# Altium schematic sheet Candunio.SchDoc
size A4
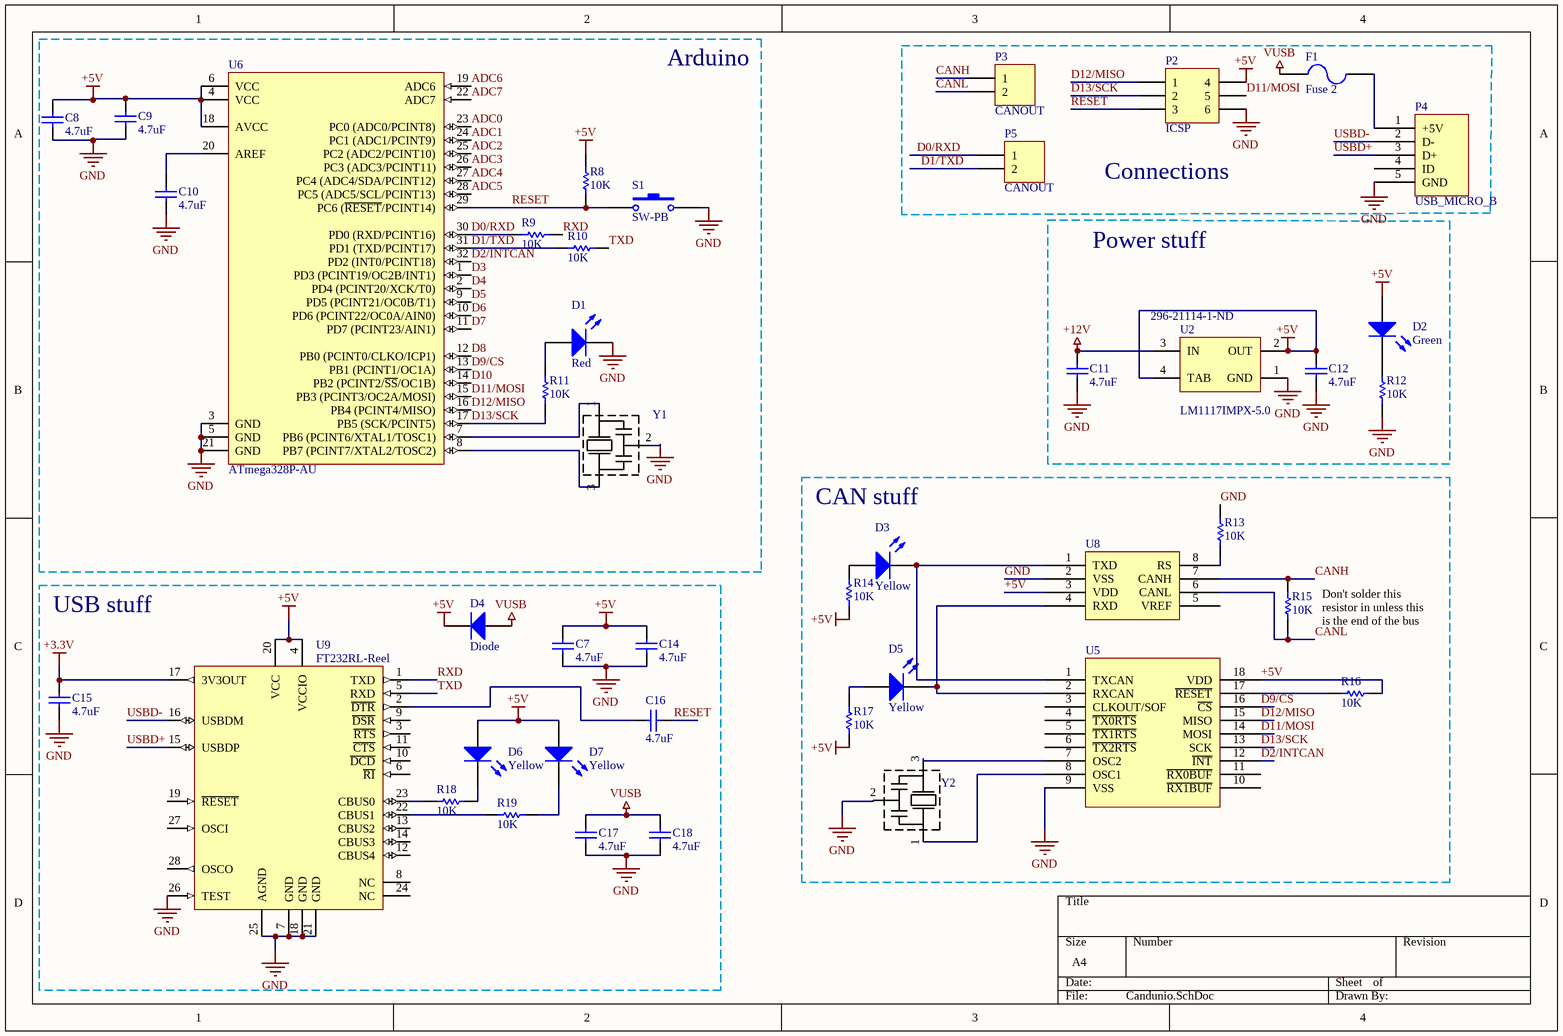
[diagram p0: Candunio.SchDoc]

## Parts
C7  4.7uF  [CAPC3216X170N]
C8  4.7uF  [CAPC3216X170N]
C9  4.7uF  [CAPC3216X170N]
C10  4.7uF  [CAPC3216X170N]
C11  4.7uF  [CAPC3216X170N]
C12  4.7uF  [CAPC3216X170N]
C14  4.7uF  [CAPC3216X170N]
C15  4.7uF  [CAPC3216X170N]
C16  4.7uF  [CAPC3216X170N]
C17  4.7uF  [CAPC3216X170N]
C18  4.7uF  [CAPC3216X170N]
D1  Red  [LEDC3216X120NRED]
D2  Green  [LEDC3216X120NGRN]
D3  Yellow  [LEDC3216X120NYEL]
D4  Diode  [DO-220AA]
D5  Yellow  [LEDC3216X120NYEL]
D6  Yellow  [LEDC3216X120NYEL]
D7  Yellow  [LEDC3216X120NYEL]
F1  Fuse 2  [FUSC4632X85N]
P2  ICSP  [Pin Header 2x3 TH Pitch 2.54mm]
P3  CANOUT  [Pin Header 1x2 TH Pitch 2.54mm]
P4  USB_MICRO_B  [USB MICRO B THRU]
P5  CANOUT  [Pin Header 1x2 TH Pitch 2.54mm]
R8  10K  [RESC3216X60N]
R9  10K  [RESC3216X60N]
R10  10K  [RESC3216X60N]
R11  10K  [RESC3216X60N]
R12  10K  [RESC3216X60N]
R13  10K  [RESC3216X60N]
R14  10K  [RESC3216X60N]
R15  10K  [RESC3216X60N]
R16  10K  [RESC3216X60N]
R17  10K  [RESC3216X60N]
R18  10K  [RESC3216X60N]
R19  10K  [RESC3216X60N]
S1  SW-PB  [SMDswitch_1206]
U2  LM1117IMPX-5.0  Supplier Part Number: 296-21114-1-ND  [SOT230P700X180-4N]
U5  MCP2515-E/ST  [SOIC127P1030X265-18N]  (value not drawn)
U6  ATmega328P-AU  [QFP80P900X900X120-32N]
U8  MCP2551-E/SN  [SOIC127P600X175-8N]  (value not drawn)
U9  FT232RL-Reel  [SOP65P780X200-28N]
Y1  CSTCE16M0V53-R0  [CSTCE_G]  (value not drawn)
Y2  CSTCE16M0V53-R0  [CSTCE_G]  (value not drawn)

## Blocks framed on the sheet
Arduino: C8-C10 D1 R8-R11 S1 U6 Y1
Connections: F1 P2-P5
Power stuff: C11 C12 D2 R12 U2
CAN stuff: D3 D5 R13-R17 U5 U8 Y2
USB stuff: C7 C14-C18 D4 D6 D7 R18 R19 U9

## Nets
+3.3V: C15.2 U9.17(3V3OUT)
+5V: C7.2 C8.1 C9.2 C12.2 C14.2 D2.1(A) D4.2(K) D6.1(A) D7.1(A) P2.4 R8.1 R14.1 R16.2 R17.2 U2.2(OUT) U2.4(TAB) U5.18(VDD) U6.4(VCC) U6.6(VCC) U6.18(AVCC) U8.3(VDD) U9.4(VCCIO) U9.20(VCC)
+12V: C11.2 U2.3(IN)
GND: C7.1 C8.2 C9.1 C10.1 C11.1 C12.1 C14.1 C15.1 C17.1 C18.1 D1.2(K) P2.6 P4.5(GND) R12.2 R13.1 S1.2 U2.1(GND) U5.9(VSS) U6.3(GND) U6.5(GND) U6.21(GND) U8.2(VSS) U9.7(GND) U9.18(GND) U9.21(GND) U9.25(AGND) U9.26(TEST) Y1.2 Y2.2
VUSB: C17.2 C18.2 D4.1(A) F1.1
ADC0: U6.23(PC0_(ADC0/PCINT8))
ADC1: U6.24(PC1_(ADC1/PCINT9))
ADC2: U6.25(PC2_(ADC2/PCINT10))
ADC3: U6.26(PC3_(ADC3/PCINT11))
ADC4: U6.27(PC4_(ADC4/SDA/PCINT12))
ADC5: U6.28(PC5_(ADC5/SCL/PCINT13))
ADC6: U6.19(ADC6)
ADC7: U6.22(ADC7)
CANH: P3.1 R15.1 U8.7(CANH)
CANL: P3.2 R15.2 U8.6(CANL)
D0/RXD: P5.1 R9.1 U6.30(PD0_(RXD/PCINT16))
D1/TXD: P5.2 R10.1 U6.31(PD1_(TXD/PCINT17))
D2/INTCAN: U5.12(~{INT}) U6.32(PD2_(INT0/PCINT18))
D3: U6.1(PD3_(PCINT19/OC2B/INT1))
D4: U6.2(PD4_(PCINT20/XCK/T0))
D5: U6.9(PD5_(PCINT21/OC0B/T1))
D6: U6.10(PD6_(PCINT22/OC0A/AIN0))
D7: U6.11(PD7_(PCINT23/AIN1))
D8: U6.12(PB0_(PCINT0/CLKO/ICP1))
D9/CS: U5.16(~{CS}) U6.13(PB1_(PCINT1/OC1A))
D10: U6.14(PB2_(PCINT2/~{SS}/OC1B))
D11/MOSI: P2.5 U5.14(MOSI) U6.15(PB3_(PCINT3/OC2A/MOSI))
D12/MISO: P2.1 U5.15(MISO) U6.16(PB4_(PCINT4/MISO))
D13/SCK: P2.2 R11.2 U5.13(SCK) U6.17(PB5_(SCK/PCINT5))
RESET: C16.2 P2.3 R8.2 S1.1 U6.29(PC6_(~{RESET}/PCINT14))
RXD: R9.2 U9.1(TXD)
TXD: R10.2 U9.5(RXD)
USBD+: P4.3(D+) U9.15(USBDP)
USBD-: P4.2(D-) U9.16(USBDM)
NetC10_2: C10.2 U6.20(AREF)
NetC16_1: C16.1 U9.2(~{DTR})
NetD1_1: D1.1(A) R11.1
NetD2_2: D2.2(K) R12.1
NetD3_1: D3.1(A) R14.2
NetD3_2: D3.2(K) U5.1(TXCAN) U8.1(TXD)
NetD5_1: D5.1(A) R17.1
NetD5_2: D5.2(K) U5.2(RXCAN) U8.4(RXD)
NetD6_2: D6.2(K) R18.2
NetD7_2: D7.2(K) R19.2
NetF1_2: F1.2 P4.1(+5V)
NetR13_2: R13.2 U8.8(RS)
NetR16_1: R16.1 U5.17(~{RESET})
NetR18_1: R18.1 U9.23(CBUS0)
NetR19_1: R19.1 U9.22(CBUS1)
NetU5_7: U5.7(OSC2) Y2.3
NetU5_8: U5.8(OSC1) Y2.1
NetU6_7: U6.7(PB6_(PCINT6/XTAL1/TOSC1)) Y1.1
NetU6_8: U6.8(PB7_(PCINT7/XTAL2/TOSC2)) Y1.3

Not connected (* = marked no-connect by the designer): P4 4(ID); U5 3(CLKOUT/SOF) 4(~{TX0RTS}) 5(~{TX1RTS}) 6(~{TX2RTS}) 10(~{RX1BUF}) 11(~{RX0BUF}); U8 5(VREF); U9 3(~{RTS}) 6(~{RI}) 8(NC) 9(~{DSR}) 10(~{DCD}) 11(~{CTS}) 12(CBUS4) 13(CBUS2) 14(CBUS3) 19(~{RESET}) 24(NC) 27(OSCI) 28(OSCO)

## Notes on the sheet
- (near R15) Don't solder this resistor in unless this is the end of the bus

## Library data of the parts
C7-C12 C14-C18 = Cap Semi: Capacitor (Semiconductor SIM Model); Manufacturer: Murata; Manufacturer Part Number: GRM31MR71H105KA88L; Material: Ceramic; Tolerance: 10%; Voltage Rating: 50V; Capacitance: 1uF; Dielectric: X7R; Published: 8-Jun-2000; LatestRevisionDate: 29-May-2009; LatestRevisionNote: IPC-7351 Footprint Added.; PackageReference: C1206; Publisher: Altium Limited; PackageDescription: Chip Capacitor; Value: 4.7uF; Supplier 1: Digi-Key; Stock 1: 0; Mount: Surface Mount; Case/Package: 1206; Number of Pins: 2; Case Code (Metric): 3216; Case Code (Imperial): 1206; Min Operating Temperature: -55°C; Max Operating Temperature: 125°C; Package Quantity: 1; Packaging: Tape and Reel; Voltage Rating (DC): 50V; Termination: SMD/SMT; Voltage: 50V; Length: 3.2mm; Height: 1.15mm; Width: 0.063inch; Thickness: 0.049inch; Depth: 1.6mm; REACH SVHC: No SVHC; Lead Free: Lead Free; ComponentLink1URL: https://datasheet.ciiva.com/16379/product-16379616.pdf; ComponentLink1Description: https://datasheet.ciiva.com/16379/product-16379616.pdf; ComponentLink2URL: https://datasheet.ciiva.com/14116/nmgrm-data-en-14116709.pdf; ComponentLink2Description: https://datasheet.ciiva.com/14116/nmgrm-data-en-14116709.pdf; ComponentLink3URL: https://datasheet.ciiva.com/22703/608985-22703384.pdf; ComponentLink3Description: https://datasheet.ciiva.com/22703/608985-22703384.pdf; ComponentLink4URL: https://datasheet.ciiva.com/3777/42grm31mr71h105ka8823-3777081.pdf; ComponentLink4Description: https://datasheet.ciiva.com/3777/42grm31mr71h105ka8823-3777081.pdf; ComponentLink5URL: https://datasheet.ciiva.com/6270/partnumbering-e-01-6270398.pdf; ComponentLink5Description: https://datasheet.ciiva.com/6270/partnumbering-e-01-6270398.pdf; ComponentLink6URL: https://datasheet.ciiva.com/6270/partnumbering-e-01-6270399.pdf; ComponentLink6Description: https://datasheet.ciiva.com/6270/partnumbering-e-01-6270399.pdf; ComponentLink7URL: https://datasheet.ciiva.com/29199/455056-da-01-en-vs-kondensator-1206-29199449.pdf; ComponentLink7Description: https://datasheet.ciiva.com/29199/455056-da-01-en-vs-kondensator-1206-29199449.pdf; ComponentLink8URL: https://datasheet.ciiva.com/29202/450923-da-01-de-vs-chip-kond-1206-1-0-uf-10pr-50-0v-x7r-29202718.pdf; ComponentLink8Description: https://datasheet.ciiva.com/29202/450923-da-01-de-vs-chip-kond-1206-1-0-uf-10pr-50-0v-x7r-29202718.pdf; Supplier 2: Digi-Key; Supplier Part Number: 1276-1055-1-ND
D1 = LED2_2: Typical RED, GREEN, YELLOW, AMBER GaAs LED; Manufacturer: Broadcom Avago; Manufacturer Part Number: HSMY-C150; Lens Colour: White,Clear; Viewing Angle: 170°; Lens Style: Diffused,Colorless,Rectangular; Wavelength: 586nm; Luminous Intensity: 8mcd; Forward Current: 20mA; Forward Voltage: 2.1V; Number of LEDs: 1; Reverse Voltage: 5V; Power Dissipation: 65mW; Lens Transparency: Diffused; Published: 8-Jun-2000; LatestRevisionDate: 17-Jul-2002; LatestRevisionNote: Re-released for DXP Platform.; PackageVersion: Feb-2002; PackageReference: 3.2X1.6X1.1; Publisher: Altium Limited; PackageDescription: SM LED; 2 Flat Leads; Supplier 1: Digi-Key; Stock 1: 0; Mount: Surface Mount; Case/Package: 1206; Number of Pins: 2; Colour: Yellow; Case Code (Metric): 3216; Case Code (Imperial): 1206; Contact Plating: Gold; Min Operating Temperature: -40°C; Max Operating Temperature: 85°C; Packaging: Tape and Reel; Package Quantity: 1; Illumination Colour: Yellow; Dominant Wavelength: 586nm; Test Current: 20mA; Number of Elements: 1; Power Rating: 65mW; Max Power Dissipation: 65mW; Voltage Rating (DC): 2.1V; Length: 3.2mm; Height: 1.1mm; Width: 1.6mm; Depth: 1.6mm; Radiation Hardening: No; REACH SVHC: No SVHC; Lead Free: Lead Free; ComponentLink1URL: https://datasheet.ciiva.com/15117/getdatasheetpartid-110528-15117488.pdf; ComponentLink1Description: https://datasheet.ciiva.com/15117/getdatasheetpartid-110528-15117488.pdf; ComponentLink2URL: https://datasheet.ciiva.com/11774/0900766b804a6539-11774578.pdf; ComponentLink2Description: https://datasheet.ciiva.com/11774/0900766b804a6539-11774578.pdf; ComponentLink3URL: https://datasheet.ciiva.com/19466/1557071-19466435.pdf; ComponentLink3Description: https://datasheet.ciiva.com/19466/1557071-19466435.pdf; ComponentLink4URL: https://datasheet.ciiva.com/14172/swseriehsmx-c150toc190-e-14172159.pdf; ComponentLink4Description: https://datasheet.ciiva.com/14172/swseriehsmx-c150toc190-e-14172159.pdf; ComponentLink5URL: https://datasheet.ciiva.com/29280/180507-da-01-en-chip-led-hsmy-c150-gelb-29280997.pdf; ComponentLink5Description: https://datasheet.ciiva.com/29280/180507-da-01-en-chip-led-hsmy-c150-gelb-29280997.pdf; Supplier 2: Digi-Key; Stock 2: 0; ComponentLink6URL: https://datasheet.ciiva.com/11773/0900766b804a6539-11773956.pdf; ComponentLink6Description: https://datasheet.ciiva.com/11773/0900766b804a6539-11773956.pdf; ComponentLink7URL: https://datasheet.ciiva.com/15117/getdatasheetpartid-142358-15117749.pdf; ComponentLink7Description: https://datasheet.ciiva.com/15117/getdatasheetpartid-142358-15117749.pdf; ComponentLink8URL: https://datasheet.ciiva.com/46426/313031-46426533.pdf; ComponentLink8Description: https://datasheet.ciiva.com/46426/313031-46426533.pdf; ComponentLink9URL: https://datasheet.ciiva.com/14172/swseriehsmx-c150toc190-e-14172156.pdf; ComponentLink9Description: https://datasheet.ciiva.com/14172/swseriehsmx-c150toc190-e-14172156.pdf; ComponentLink10URL: https://datasheet.ciiva.com/29281/180509-da-01-en-chip-led-hsmh-c150-rot-29281009.pdf; ComponentLink10Description: https://datasheet.ciiva.com/29281/180509-da-01-en-chip-led-hsmh-c150-rot-29281009.pdf; Supplier 3: Digi-Key; Supplier 4: Digi-Key; Supplier Part Number: 732-4992-1-ND
D2 = LED2: Typical RED, GREEN, YELLOW, AMBER GaAs LED; Manufacturer: Broadcom Avago; Manufacturer Part Number: HSMG-C150; Lens Colour: White,Clear; Viewing Angle: 170°; Lens Style: Diffused,Colorless,Rectangular; Luminous Intensity: 15mcd; Forward Voltage: 2.2V; Forward Current: 20mA; Wavelength: 572nm; Number of LEDs: 1; Power Rating: 65mW; Reverse Voltage: 5V; Lens Transparency: Diffused; Published: 8-Jun-2000; LatestRevisionDate: 17-Jul-2002; LatestRevisionNote: Re-released for DXP Platform.; PackageVersion: Feb-2002; PackageReference: 3.2X1.6X1.1; Publisher: Altium Limited; PackageDescription: SM LED; 2 Flat Leads; Mount: Surface Mount; Case/Package: 1206; Number of Pins: 2; Colour: Green,Yellow; Case Code (Metric): 3216; Case Code (Imperial): 1206; Contact Plating: Gold; Min Operating Temperature: -30°C; Max Operating Temperature: 85°C; Packaging: Tape and Reel; Package Quantity: 1; Illumination Colour: Green; Dominant Wavelength: 572nm; Test Current: 20mA; Number of Elements: 1; Power Dissipation: 65mW; Max Power Dissipation: 65mW; Length: 3.2mm; Height: 1.1mm; Width: 1.6mm; Depth: 1.6mm; Radiation Hardening: No; REACH SVHC: No SVHC; ComponentLink1URL: https://datasheet.ciiva.com/11774/0900766b804a6539-11774272.pdf; ComponentLink1Description: https://datasheet.ciiva.com/11774/0900766b804a6539-11774272.pdf; ComponentLink2URL: https://datasheet.ciiva.com/14172/swseriehsmx-c150toc190-e-14172162.pdf; ComponentLink2Description: https://datasheet.ciiva.com/14172/swseriehsmx-c150toc190-e-14172162.pdf; ComponentLink3URL: https://datasheet.ciiva.com/46426/313031-46426517.pdf; ComponentLink3Description: https://datasheet.ciiva.com/46426/313031-46426517.pdf; ComponentLink4URL: https://datasheet.ciiva.com/15117/getdatasheetpartid-110366-15117482.pdf; ComponentLink4Description: https://datasheet.ciiva.com/15117/getdatasheetpartid-110366-15117482.pdf; ComponentLink5URL: https://datasheet.ciiva.com/19466/1556369-19466015.pdf; ComponentLink5Description: https://datasheet.ciiva.com/19466/1556369-19466015.pdf; ComponentLink6URL: https://datasheet.ciiva.com/29280/180668-da-01-en-chip-led-hsmg-c150-gelb-gruen-29280632.pdf; ComponentLink6Description: https://datasheet.ciiva.com/29280/180668-da-01-en-chip-led-hsmg-c150-gelb-gruen-29280632.pdf; Supplier 1: Digi-Key; Supplier 2: Digi-Key; Supplier Part Number: 732-4993-1-ND
D3 D5-D7 = LED2_1: Typical RED, GREEN, YELLOW, AMBER GaAs LED; Manufacturer: Broadcom Avago; Manufacturer Part Number: HSMY-C150; Lens Colour: White,Clear; Viewing Angle: 170°; Lens Style: Diffused,Colorless,Rectangular; Wavelength: 586nm; Luminous Intensity: 8mcd; Forward Current: 20mA; Forward Voltage: 2.1V; Number of LEDs: 1; Reverse Voltage: 5V; Power Dissipation: 65mW; Lens Transparency: Diffused; Published: 8-Jun-2000; LatestRevisionDate: 17-Jul-2002; LatestRevisionNote: Re-released for DXP Platform.; PackageVersion: Feb-2002; PackageReference: 3.2X1.6X1.1; Publisher: Altium Limited; PackageDescription: SM LED; 2 Flat Leads; Supplier 1: Digi-Key; Stock 1: 0; Mount: Surface Mount; Case/Package: 1206; Number of Pins: 2; Colour: Yellow; Case Code (Metric): 3216; Case Code (Imperial): 1206; Contact Plating: Gold; Min Operating Temperature: -40°C; Max Operating Temperature: 85°C; Packaging: Tape and Reel; Package Quantity: 1; Illumination Colour: Yellow; Dominant Wavelength: 586nm; Test Current: 20mA; Number of Elements: 1; Power Rating: 65mW; Max Power Dissipation: 65mW; Voltage Rating (DC): 2.1V; Length: 3.2mm; Height: 1.1mm; Width: 1.6mm; Depth: 1.6mm; Radiation Hardening: No; REACH SVHC: No SVHC; Lead Free: Lead Free; ComponentLink1URL: https://datasheet.ciiva.com/15117/getdatasheetpartid-110528-15117488.pdf; ComponentLink1Description: https://datasheet.ciiva.com/15117/getdatasheetpartid-110528-15117488.pdf; ComponentLink2URL: https://datasheet.ciiva.com/11774/0900766b804a6539-11774578.pdf; ComponentLink2Description: https://datasheet.ciiva.com/11774/0900766b804a6539-11774578.pdf; ComponentLink3URL: https://datasheet.ciiva.com/19466/1557071-19466435.pdf; ComponentLink3Description: https://datasheet.ciiva.com/19466/1557071-19466435.pdf; ComponentLink4URL: https://datasheet.ciiva.com/14172/swseriehsmx-c150toc190-e-14172159.pdf; ComponentLink4Description: https://datasheet.ciiva.com/14172/swseriehsmx-c150toc190-e-14172159.pdf; ComponentLink5URL: https://datasheet.ciiva.com/29280/180507-da-01-en-chip-led-hsmy-c150-gelb-29280997.pdf; ComponentLink5Description: https://datasheet.ciiva.com/29280/180507-da-01-en-chip-led-hsmy-c150-gelb-29280997.pdf; Supplier 2: Digi-Key; Supplier Part Number: 732-4994-1-ND
D4 = Diode: Default Diode; Published: 8-Jun-2000; LatestRevisionDate: 17-Jul-2002; LatestRevisionNote: Re-released for DXP Platform.; PackageVersion: Sep-1996; PackageReference: SMC; Publisher: Altium Limited; PackageDescription: DO-214-AB/SMC; 2 C-Bend Leads; Body 7.9 x 5.9 mm, inc. leads (LxW); Code_JEDEC: DO-214-AB; Supplier 1: Digi-Key; Supplier 2: Digi-Key; Supplier Part Number: SS1P3L-M3/84AGICT-ND
F1 = Fuse 2: Fuse; part number: MF-MSMF050-2; Manufacturer: Bourns; Max Current Rating: 100A; Hold Current: 500mA; Trip Current: 1A; Power Dissipation: 800mW; Voltage Rating: 15V; Resistance: 150mR; Time to Trip: 0.15s; Approvals: UL,CSA,TUV; Published: 8-Jun-2000; LatestRevisionDate: 17-Jul-2002; LatestRevisionNote: Re-released for DXP Platform.; PackageReference: PIN-W2/E2.8; Publisher: Altium Limited; PackageDescription: Thru-Hole; 2 Leads; Supplier 1: Digi-Key; Supplier Part Number: ‎MF-MSMF050-2CT-ND; Manufacturer Part Number: MF-MSMF050-2; Stock 1: 126000; Pricing 1: 2000=0.2898, 4000=0.28463, 6000=0.27945, 10000=0.2691 (USD); Mount: Surface Mount,PCB; Case/Package: 1812; Case Code (Metric): 4532; Case Code (Imperial): 1812; Number of Terminals: 2; Contact Plating: Gold; Terminal Material: Gold; Min Operating Temperature: -40°C; Max Operating Temperature: 85°C; Packaging: Tape and Reel; Package Quantity: 2000; Operating Supply Voltage: 15V; Current Rating: 100A; Termination: SMD/SMT; Voltage Rating (DC): 15V; Length: 4.73mm; Height: 0.85mm; Width: 3.41mm; Radiation Hardening: No; REACH SVHC: No SVHC; Lead Free: Lead Free; ComponentLink1URL: https://datasheet.ciiva.com/326/mfmsmf-326354.pdf; ComponentLink1Description: https://datasheet.ciiva.com/326/mfmsmf-326354.pdf; ComponentLink2URL: https://datasheet.ciiva.com/1228/1786007-1228155.pdf; ComponentLink2Description: https://datasheet.ciiva.com/1228/1786007-1228155.pdf; ComponentLink3URL: https://datasheet.ciiva.com/16205/mfmsmf-16205994.pdf; ComponentLink3Description: https://datasheet.ciiva.com/16205/mfmsmf-16205994.pdf; ComponentLink4URL: https://datasheet.ciiva.com/34302/1164200-34302041.pdf; ComponentLink4Description: https://datasheet.ciiva.com/34302/1164200-34302041.pdf; ComponentLink5URL: https://datasheet.ciiva.com/14537/70153434-14537737.pdf; ComponentLink5Description: https://datasheet.ciiva.com/14537/70153434-14537737.pdf; ComponentLink6URL: https://datasheet.ciiva.com/46395/1695373-46395287.pdf; ComponentLink6Description: https://datasheet.ciiva.com/46395/1695373-46395287.pdf; ComponentLink7URL: https://datasheet.ciiva.com/22749/1695373-22749079.pdf; ComponentLink7Description: https://datasheet.ciiva.com/22749/1695373-22749079.pdf; ComponentLink8URL: https://datasheet.ciiva.com/32426/mf-msmf-series-eng-tds-32426126.pdf; ComponentLink8Description: https://datasheet.ciiva.com/32426/mf-msmf-series-eng-tds-32426126.pdf; ComponentLink9URL: https://datasheet.ciiva.com/4501/mfmsmf-72300-4501655.pdf; ComponentLink9Description: https://datasheet.ciiva.com/4501/mfmsmf-72300-4501655.pdf; ComponentLink10URL: https://datasheet.ciiva.com/3019/mfmsmf-3019622.pdf; ComponentLink10Description: https://datasheet.ciiva.com/3019/mfmsmf-3019622.pdf; ComponentLink11URL: https://datasheet.ciiva.com/3019/mfmsmf-3019621.pdf; ComponentLink11Description: https://datasheet.ciiva.com/3019/mfmsmf-3019621.pdf; ComponentLink12URL: https://datasheet.ciiva.com/326/mfmsmf-326356.pdf; ComponentLink12Description: https://datasheet.ciiva.com/326/mfmsmf-326356.pdf; ComponentLink13URL: https://datasheet.ciiva.com/1274/1786007-1274499.pdf; ComponentLink13Description: https://datasheet.ciiva.com/1274/1786007-1274499.pdf; ComponentLink14URL: https://datasheet.ciiva.com/326/mfmsmf-326355.pdf; ComponentLink14Description: https://datasheet.ciiva.com/326/mfmsmf-326355.pdf; ComponentLink15URL: https://datasheet.ciiva.com/1274/1786007-1274498.pdf; ComponentLink15Description: https://datasheet.ciiva.com/1274/1786007-1274498.pdf; ComponentLink16URL: https://datasheet.ciiva.com/15226/getdatasheetpartid-117168-15226886.pdf; ComponentLink16Description: https://datasheet.ciiva.com/15226/getdatasheetpartid-117168-15226886.pdf; ComponentLink17URL: https://datasheet.ciiva.com/25894/mfmsmf-25894175.pdf; ComponentLink17Description: https://datasheet.ciiva.com/25894/mfmsmf-25894175.pdf
P2 = Header 3X2A: Header, 3-Pin, Dual row; LatestRevisionDate: 17-Jul-2002; LatestRevisionNote: Re-released for DXP Platform.; Publisher: Altium Limited
P3 P5 = Header 2: Header, 2-Pin; LatestRevisionDate: 17-Jul-2002; LatestRevisionNote: Re-released for DXP Platform.; Publisher: Altium Limited
R8-R14 R16-R19 = Res1: Resistor; Manufacturer: Stackpole Electronics; Manufacturer Part Number: RNCP1206FTD1K00; Resistance: 10kR; Tolerance: 1%; Temperature Coefficient: 100ppm/°C; Max Power Dissipation: 500mW; Value: 10K; Supplier Part Number: RNCP1206FTD10K0CT-ND; Supplier 1: Digi-Key; Stock 1: 679; Pricing 1: 1=0.1, 10=0.052, 100=0.0211, 1000=0.00949, 2500=0.00824 (USD); Mount: Surface Mount; Case/Package: 1206; Case Code (Metric): 3216; Case Code (Imperial): 1206; Contact Plating: Nickel,Tin,Matte; Min Operating Temperature: -55°C; Max Operating Temperature: 155°C; Packaging: Tape and Reel; Composition: Thin Film; Number of Terminations: 2; Length: 0.122inch; Height: 0.024inch; Width: 0.059inch; Radiation Hardening: No; Lead Free: Lead Free; ComponentLink1URL: http://www.seielect.com/Catalog/SEI-rncp.pdf; ComponentLink1Description: http://www.seielect.com/Catalog/SEI-rncp.pdf; ComponentLink2URL: https://www.seielect.com/catalog/SEI-Packaging.pdf; ComponentLink2Description: https://www.seielect.com/catalog/SEI-Packaging.pdf
R15 = Res1: Resistor; Manufacturer: Stackpole Electronics; Manufacturer Part Number: RNCP1206FTD1K00; Resistance: 10kR; Temperature Coefficient: 100ppm/°C; Tolerance: 1%; Max Power Dissipation: 500mW; Value: 10K; Supplier 1: Digi-Key; Stock 1: 679; Case/Package: 1206; Case Code (Imperial): 1206; Case Code (Metric): 3216; Contact Plating: Nickel,Tin,Matte; Min Operating Temperature: -55°C; Max Operating Temperature: 155°C; Packaging: Tape and Reel; Composition: Thin Film; Length: 0.122inch; Height: 0.024inch; Width: 0.059inch; Radiation Hardening: No; Lead Free: Lead Free; ComponentLink1URL: http://www.seielect.com/Catalog/SEI-rncp.pdf; ComponentLink1Description: http://www.seielect.com/Catalog/SEI-rncp.pdf; ComponentLink2URL: https://www.seielect.com/catalog/SEI-Packaging.pdf; ComponentLink2Description: https://www.seielect.com/catalog/SEI-Packaging.pdf; Supplier Part Number: RNCP1206FTD10K0CT-ND; Pricing 1: 1=0.1, 10=0.052, 100=0.0211, 1000=0.00949, 2500=0.00824 (USD); Mount: Surface Mount; Number of Terminations: 2
S1 = SW-PB: Switch; Manufacturer: ITT C&K; Manufacturer Part Number: KXT331LHS; Published: 24-Mar-1999; LatestRevisionDate: 17-Jul-2002; LatestRevisionNote: Re-released for DXP Platform.; PackageReference: SPST-2; Publisher: Altium Limited; PackageDescription: Switch; 2 Leads; Supplier 1: Digi-Key; Supplier Part Number: CKN10779CT-ND; Stock 1: 42500; Pricing 1: 8500=0.1264 (USD); ComponentLink1URL: https://www.ckswitches.com/media/1465/kxt3.pdf; ComponentLink1Description: https://www.ckswitches.com/media/1465/kxt3.pdf; ComponentLink2URL: http://www.ckswitches.com/media/1465/kxt3.pdf; ComponentLink2Description: http://www.ckswitches.com/media/1465/kxt3.pdf
U2 = LM1117IMPX-5.0: 800mA Low-Dropout Linear Regulator, 4-pin SOT-223; PartNumber: LM1117IMPX-5.0/NOPBCT-ND; Manufacturer: National Semiconductor; PackageTopMarking: XYTT*N06B; PowerWise: N; CompType: LDO IC; Published: 1-Mar-2010; DatasheetVersion: Apr-2006; PackageVersion: revB, Apr-2003; PackageReference: MP04A; Publisher: Altium Limited; PackageDescription: Molded SOT-223, 6.50 x 3.56 x 1.6mm Body, 4 Lead, 2.3mm Pitch; RoHS: N; PinCount: 4; Code_JEDEC: TO-261-AA; Code_IPC: SOT223-4; ComponentLink1Description: LM1117 Datasheet; ComponentLink1URL: http://www.national.com/ds/LM/LM1117.pdf; ComponentLink2Description: LM1117 Web Page; ComponentLink2URL: http://www.national.com/pf/LM/LM1117.html; ComponentLink3Description: MP04A Package Page; ComponentLink3URL: http://www.national.com/packaging/folders/mp04a.html; Supplier 1: Digi-Key
U5 = MCP2515-E/ST: SOIC; Supplier 1: Digi-Key; Supplier Part Number: MCP2515T-I/SOCT-ND
U6 = ATmega328P-AU: 8-bit AVR Microcontroller, 32KB Flash, 1KB EEPROM, 2KB SRAM, 32-pin TQFP, Industrial Grade (-40°C to 85°C); Published: 1-Apr-2010; DatasheetVersion: revA, Jan-2010; PackageVersion: revB, Oct-2001; PackageReference: 32A; Publisher: Altium Limited; PackageDescription: 32-Lead, 7x7x1.0 mm Body, 0.8mm Lead Pitch, Thin Profile Plastic Quad Flat Package (TQFP); Supplier 1: Digi-Key; Supplier Part Number: ATMEGA328P-AU-ND; Supplier 2: Farnell; Supplier Part Number 2: 1715486; Supplier 3: Mouser; Supplier Part Number 3: 556-ATMEGA328P-AU; Code_JEDEC: MS-026-ABA; ComponentLink1Description: Manufacturer Link; ComponentLink1URL: http://www.atmel.com/products/avr/default.asp?; ComponentLink2Description: ATmega48A/48PA/88A/88PA/168A/168PA/328/328P Datasheet; ComponentLink2URL: http://www.atmel.com/dyn/resources/prod_documents/8271.pdf; ComponentLink3Description: ATmega48A/48PA/88A/88PA/168A/168PA/328/328P Summary; ComponentLink3URL: http://www.atmel.com/dyn/resources/prod_documents/8271S.pdf; ComponentLink4Description: Atmel.com Home; ComponentLink4URL: http://www.atmel.com
U8 = MCP2551-E/SN: SOIC; Supplier 1: Digi-Key; Supplier Part Number: MCP2551T-E/SNCT-ND
U9 = FT232RL-Reel: USB UART Asynchronous Serial Data Transfer Chip, SSOP-28, Tape and Reel; Manufacturer: FTDI; Interface: RS-232,RS-422,RS-485,UART; Number of Channels: 1; Max Supply Voltage: 5.25V; Min Supply Voltage: 3.3V; Data Rate: 12Mbps; Operating Supply Current: 15mA; Voltage: 5V; Published: 19-Aug-2010; DatasheetVersion: ver 2.07, Jul-2010; PackageVersion: 2010; PackageReference: SSOP-28; Publisher: Altium Limited; PackageDescription: 28-Pin Small Outline Package 0.65 mm Pitch; ComponentLink1Description: Manufacturer Link; ComponentLink1URL: http://www.ftdichip.com/Products/ICs/FT232R.htm; ComponentLink2Description: Datasheet; ComponentLink2URL: http://www.ftdichip.com/Support/Documents/DataSheets/ICs/DS_FT232R.pdf; Supplier 1: Digi-Key; Manufacturer Part Number: FT232RL-REEL; Stock 1: 216496; Pricing 1: 1=4.5, 10=4.05, 100=3.65, 250=3.25, 500=2.85002, 1000=2.65 (USD); Mount: Surface Mount; Case/Package: SSOP; Number of Pins: 28; Weight: 0.080001oz; Min Operating Temperature: -40°C; Max Operating Temperature: 85°C; Packaging: Tape and Reel; Package Quantity: 2000; Number of Transceivers: 1; Length: 10.2mm; Height: 1.75mm; Width: 5.3mm; Radiation Hardening: No; REACH SVHC: No SVHC; Lead Free: Lead Free; ComponentLink3URL: https://datasheet.ciiva.com/34304/2161019-34304054.pdf; ComponentLink3Description: https://datasheet.ciiva.com/34304/2161019-34304054.pdf; ComponentLink4URL: https://datasheet.ciiva.com/1787/ds-ft232r-1787047.pdf; ComponentLink4Description: https://datasheet.ciiva.com/1787/ds-ft232r-1787047.pdf; ComponentLink5URL: https://datasheet.ciiva.com/1787/ds-ft232r-1787048.pdf; ComponentLink5Description: https://datasheet.ciiva.com/1787/ds-ft232r-1787048.pdf; ComponentLink6URL: https://datasheet.ciiva.com/1787/ds-ft232r-1787049.pdf; ComponentLink6Description: https://datasheet.ciiva.com/1787/ds-ft232r-1787049.pdf; ComponentLink7URL: https://datasheet.ciiva.com/4787/ds-ft232r-11534-4787658.pdf; ComponentLink7Description: https://datasheet.ciiva.com/4787/ds-ft232r-11534-4787658.pdf; ComponentLink8URL: https://datasheet.ciiva.com/15150/getdatasheetpartid-643207-15150506.pdf; ComponentLink8Description: https://datasheet.ciiva.com/15150/getdatasheetpartid-643207-15150506.pdf; ComponentLink9URL: https://datasheet.ciiva.com/16200/ds-ft232r-16200652.pdf; ComponentLink9Description: https://datasheet.ciiva.com/16200/ds-ft232r-16200652.pdf; ComponentLink10URL: https://datasheet.ciiva.com/26841/ft232rl-reel-26841080.pdf; ComponentLink10Description: https://datasheet.ciiva.com/26841/ft232rl-reel-26841080.pdf; Supplier 2: Digi-Key; Supplier Part Number: 768-1007-1-ND
Y1 Y2 = CSTCE16M0V53-R0: Manufacturer: Murata; Manufacturer Part Number: CSTCE16M0V53C-R0; Frequency: 16MHz; Frequency Tolerance: 0.5%; Frequency Stability: 0.15%; Capacitance: 15pF; Supplier Part Number: 490-17948-1-ND; Supplier 1: Digi-Key; Stock 1: 0; Mount: Surface Mount; Case/Package: SMD/SMT; Number of Pins: 3; Contact Plating: Gold; Min Operating Temperature: -40°C; Max Operating Temperature: 125°C; Packaging: Tape and Reel; Composition: Ceramic; Package Quantity: 3000; Termination: SMD/SMT; Tolerance: 0.5%; Length: 0.126inch; Height: 0.031inch; Width: 0.051inch; REACH SVHC: No SVHC; Lead Free: Lead Free; ComponentLink1URL: https://datasheet.ciiva.com/16430/cstce16m0v53c-r0-16430704.pdf; ComponentLink1Description: https://datasheet.ciiva.com/16430/cstce16m0v53c-r0-16430704.pdf; ComponentLink2URL: https://datasheet.ciiva.com/14132/ceralock-eng-bro-14132709.pdf; ComponentLink2Description: https://datasheet.ciiva.com/14132/ceralock-eng-bro-14132709.pdf; ComponentLink3URL: https://datasheet.ciiva.com/29617/l0430e-29617948.pdf; ComponentLink3Description: https://datasheet.ciiva.com/29617/l0430e-29617948.pdf; ComponentLink4URL: https://datasheet.ciiva.com/29617/l0430e-29617949.pdf; ComponentLink4Description: https://datasheet.ciiva.com/29617/l0430e-29617949.pdf; ComponentLink5URL: https://datasheet.ciiva.com/29617/l0430e-29617950.pdf; ComponentLink5Description: https://datasheet.ciiva.com/29617/l0430e-29617950.pdf; ComponentLink6URL: https://datasheet.ciiva.com/26812/getdatasheetpartid-418508-26812063.pdf; ComponentLink6Description: https://datasheet.ciiva.com/26812/getdatasheetpartid-418508-26812063.pdf